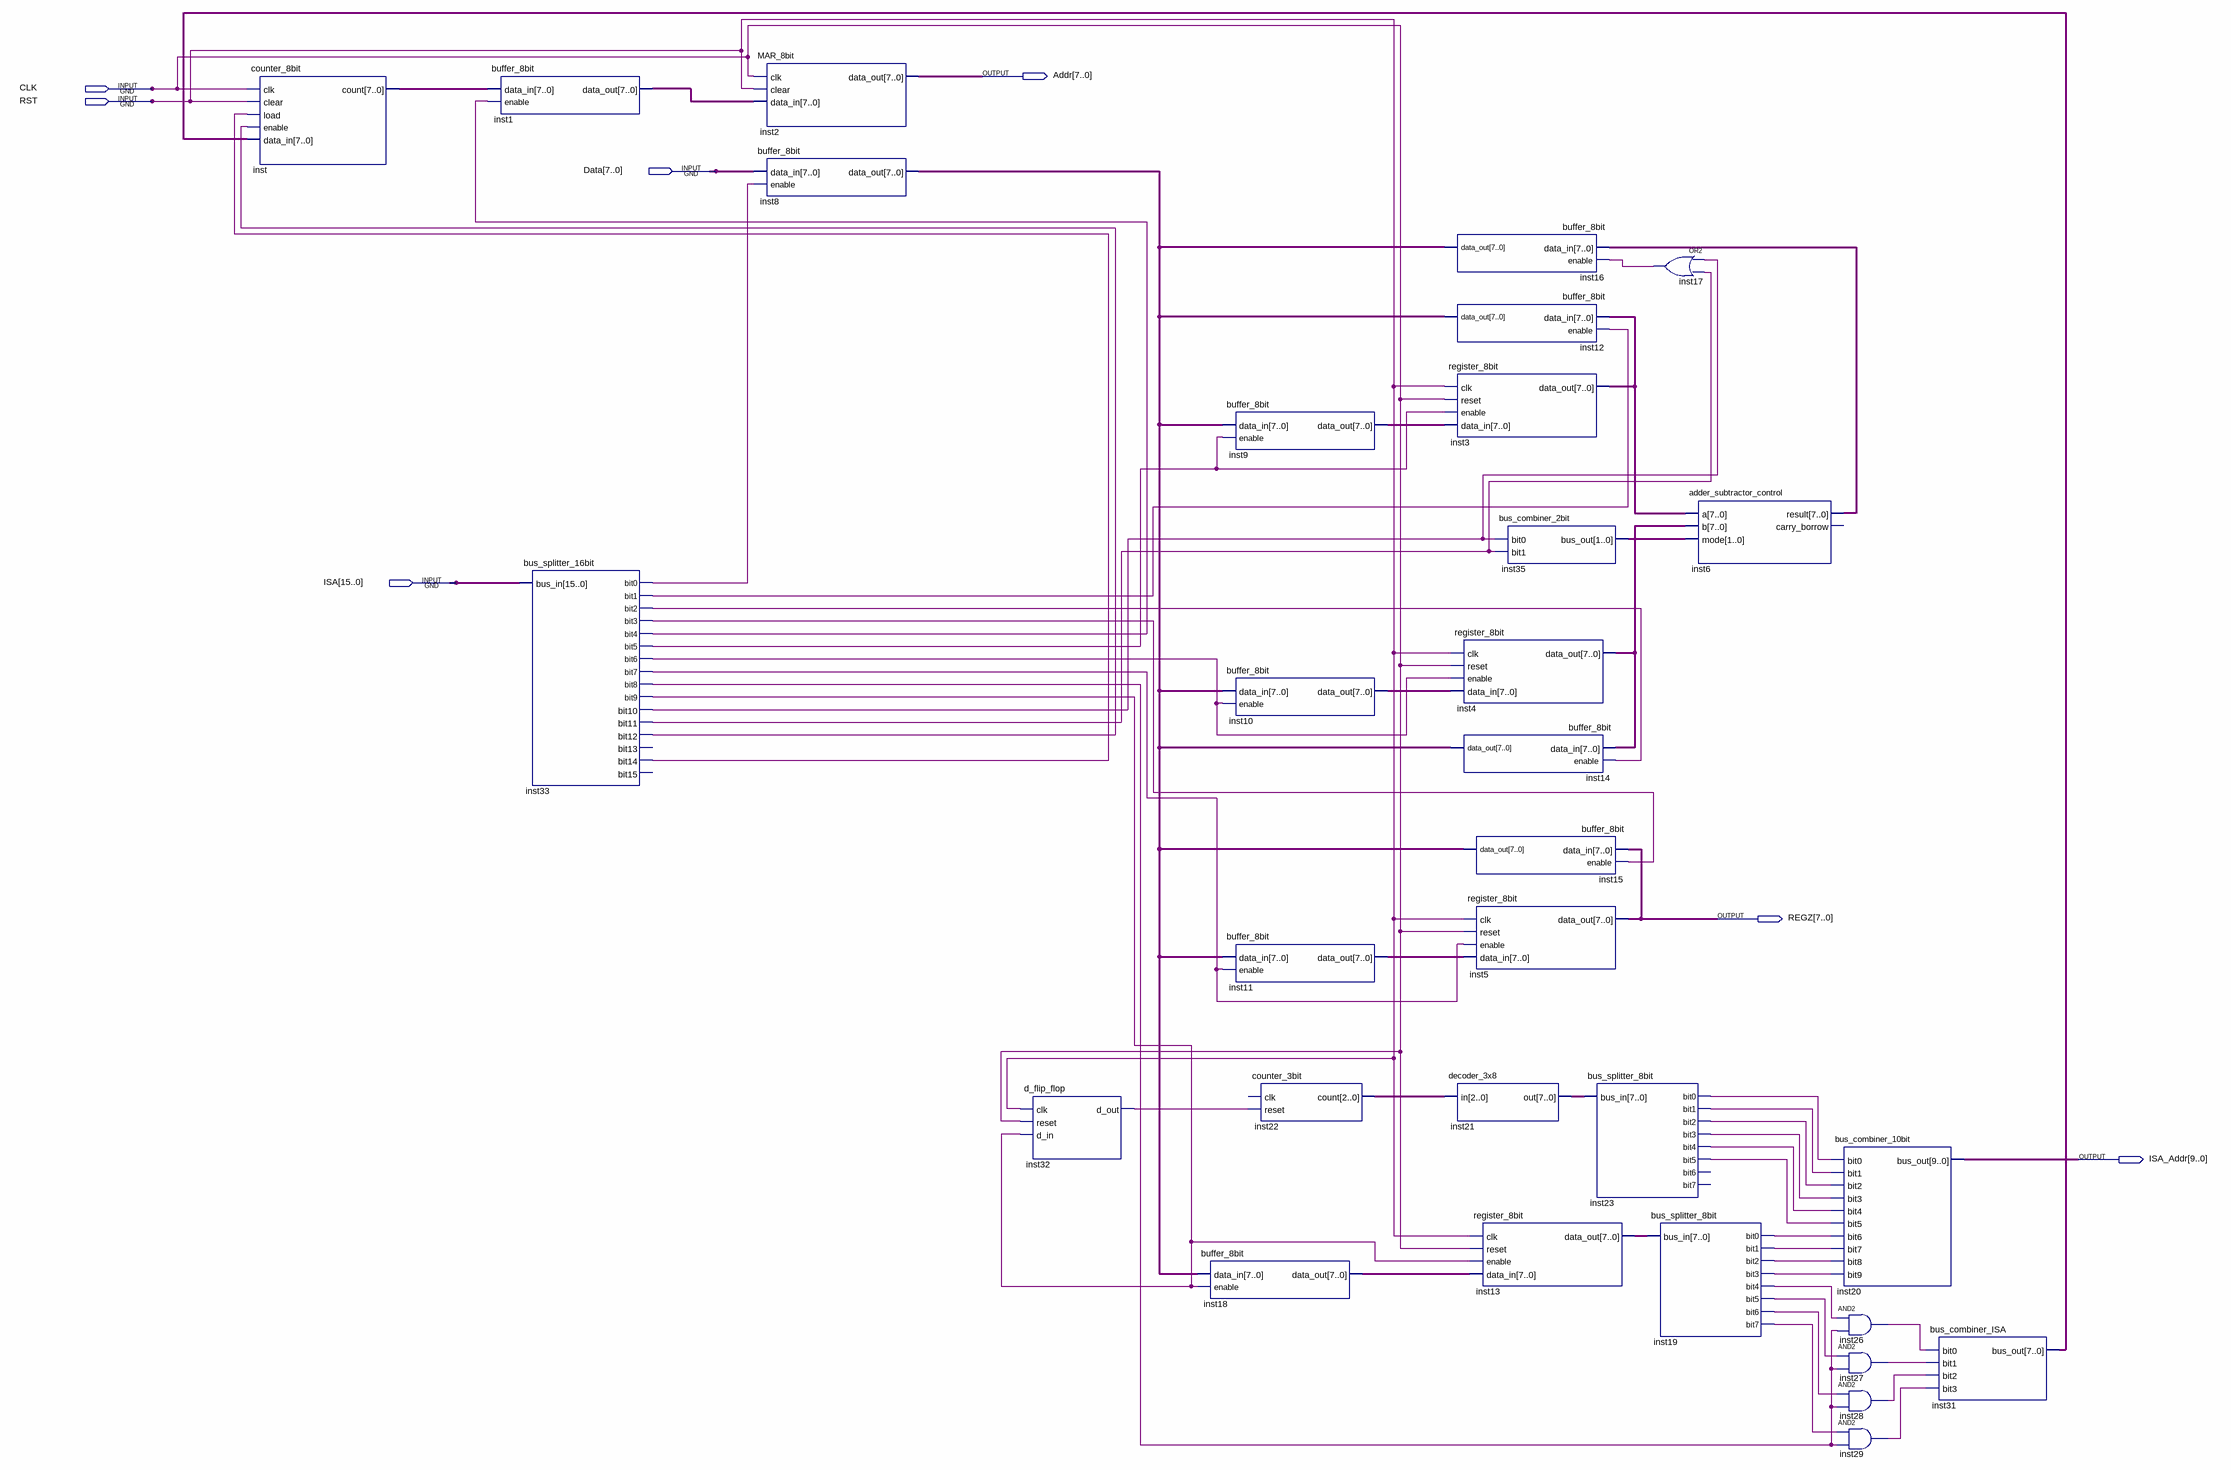
[diagram p0: schematic sheet]
// Quartus schematic Main_Block.bdf as structural Verilog: 31 symbols, 7 pins
module Main_Block (
  input  CLK,
  input  RST,
  input  [7:0] Data,
  input  [15:0] ISA,
  output [7:0] Addr,
  output [7:0] REGZ,
  output [9:0] ISA_Addr
);

  wire inst17_out, inst19_bit0, inst19_bit1, inst19_bit2, inst19_bit3, inst19_bit4, inst19_bit5, inst19_bit6,
       inst19_bit7, inst23_bit0, inst23_bit1, inst23_bit2, inst23_bit3, inst23_bit4, inst23_bit5, inst26_out,
       inst27_out, inst28_out, inst29_out, inst32_d_out, inst33_bit0, inst33_bit1, inst33_bit2, inst33_bit3,
       inst33_bit4, inst33_bit5, inst33_bit6, inst33_bit7, inst33_bit8, inst33_bit9, inst33_bit10,
       inst33_bit11, inst33_bit12, inst33_bit14;
  wire [1:0] inst35_bus_out;
  wire [2:0] inst22_count;
  wire [7:0] inst1_data_out, inst3_data_out, inst4_data_out, inst6_result, inst8_data_out, inst9_data_out,
       inst10_data_out, inst11_data_out, inst13_data_out, inst18_data_out, inst21_out, inst31_bus_out,
       inst_count;

  counter_8bit inst (
    .clk(CLK), .clear(RST), .load(inst33_bit14), .enable(inst33_bit12), .data_in(inst31_bus_out),
    .count(inst_count));
  buffer_8bit inst1 (.data_in(inst_count), .enable(inst33_bit4), .data_out(inst1_data_out));
  bus_splitter_16bit inst33 (
    .bus_in(ISA), .bit0(inst33_bit0), .bit1(inst33_bit1), .bit2(inst33_bit2), .bit3(inst33_bit3),
    .bit4(inst33_bit4), .bit5(inst33_bit5), .bit6(inst33_bit6), .bit7(inst33_bit7), .bit8(inst33_bit8),
    .bit9(inst33_bit9), .bit10(inst33_bit10), .bit11(inst33_bit11), .bit12(inst33_bit12), .bit14(inst33_bit14));  // open: bit13, bit15
  MAR_8bit inst2 (.clk(CLK), .clear(RST), .data_in(inst1_data_out), .data_out(Addr));
  buffer_8bit inst8 (.data_in(Data), .enable(inst33_bit0), .data_out(inst8_data_out));
  d_flip_flop inst32 (.clk(RST), .reset(CLK), .d_in(inst33_bit9), .d_out(inst32_d_out));
  buffer_8bit inst9 (.data_in(inst8_data_out), .enable(inst33_bit5), .data_out(inst9_data_out));
  buffer_8bit inst10 (.data_in(inst8_data_out), .enable(inst33_bit6), .data_out(inst10_data_out));
  buffer_8bit inst11 (.data_in(inst8_data_out), .enable(inst33_bit7), .data_out(inst11_data_out));
  buffer_8bit inst18 (.data_in(inst8_data_out), .enable(inst33_bit9), .data_out(inst18_data_out));
  counter_3bit inst22 (.reset(inst32_d_out), .count(inst22_count));  // open: clk
  buffer_8bit inst16 (.data_in(inst6_result), .enable(inst17_out), .data_out(inst8_data_out));
  buffer_8bit inst12 (.data_in(inst3_data_out), .enable(inst33_bit1), .data_out(inst8_data_out));
  register_8bit inst3 (
    .clk(RST), .reset(CLK), .enable(inst33_bit5), .data_in(inst9_data_out), .data_out(inst3_data_out));
  decoder_3x8 inst21 (.in(inst22_count), .out(inst21_out));
  bus_combiner_2bit inst35 (.bit0(inst33_bit10), .bit1(inst33_bit11), .bus_out(inst35_bus_out));
  register_8bit inst4 (
    .clk(RST), .reset(CLK), .enable(inst33_bit6), .data_in(inst10_data_out), .data_out(inst4_data_out));
  buffer_8bit inst14 (.data_in(inst4_data_out), .enable(inst33_bit2), .data_out(inst8_data_out));
  buffer_8bit inst15 (.data_in(REGZ), .enable(inst33_bit3), .data_out(inst8_data_out));
  register_8bit inst5 (.clk(RST), .reset(CLK), .enable(inst33_bit7), .data_in(inst11_data_out), .data_out(REGZ));
  register_8bit inst13 (
    .clk(RST), .reset(CLK), .enable(inst33_bit9), .data_in(inst18_data_out), .data_out(inst13_data_out));
  bus_splitter_8bit inst23 (
    .bus_in(inst21_out), .bit0(inst23_bit0), .bit1(inst23_bit1), .bit2(inst23_bit2), .bit3(inst23_bit3),
    .bit4(inst23_bit4), .bit5(inst23_bit5));  // open: bit6, bit7
  bus_splitter_8bit inst19 (
    .bus_in(inst13_data_out), .bit0(inst19_bit0), .bit1(inst19_bit1), .bit2(inst19_bit2), .bit3(inst19_bit3),
    .bit4(inst19_bit4), .bit5(inst19_bit5), .bit6(inst19_bit6), .bit7(inst19_bit7));
  or inst17 (inst17_out, inst33_bit10, inst33_bit11);
  adder_subtractor_control inst6 (
    .a(inst3_data_out), .b(inst4_data_out), .mode(inst35_bus_out), .result(inst6_result));  // open: carry_borrow
  bus_combiner_10bit inst20 (
    .bit0(inst23_bit0), .bit1(inst23_bit1), .bit2(inst23_bit2), .bit3(inst23_bit3), .bit4(inst23_bit4),
    .bit5(inst23_bit5), .bit6(inst19_bit0), .bit7(inst19_bit1), .bit8(inst19_bit2), .bit9(inst19_bit3),
    .bus_out(ISA_Addr));
  and inst26 (inst26_out, inst19_bit4, inst33_bit8);
  and inst27 (inst27_out, inst19_bit5, inst33_bit8);
  and inst28 (inst28_out, inst19_bit6, inst33_bit8);
  and inst29 (inst29_out, inst19_bit7, inst33_bit8);
  bus_combiner_ISA inst31 (
    .bit0(inst26_out), .bit1(inst27_out), .bit2(inst28_out), .bit3(inst29_out), .bus_out(inst31_bus_out));
endmodule
